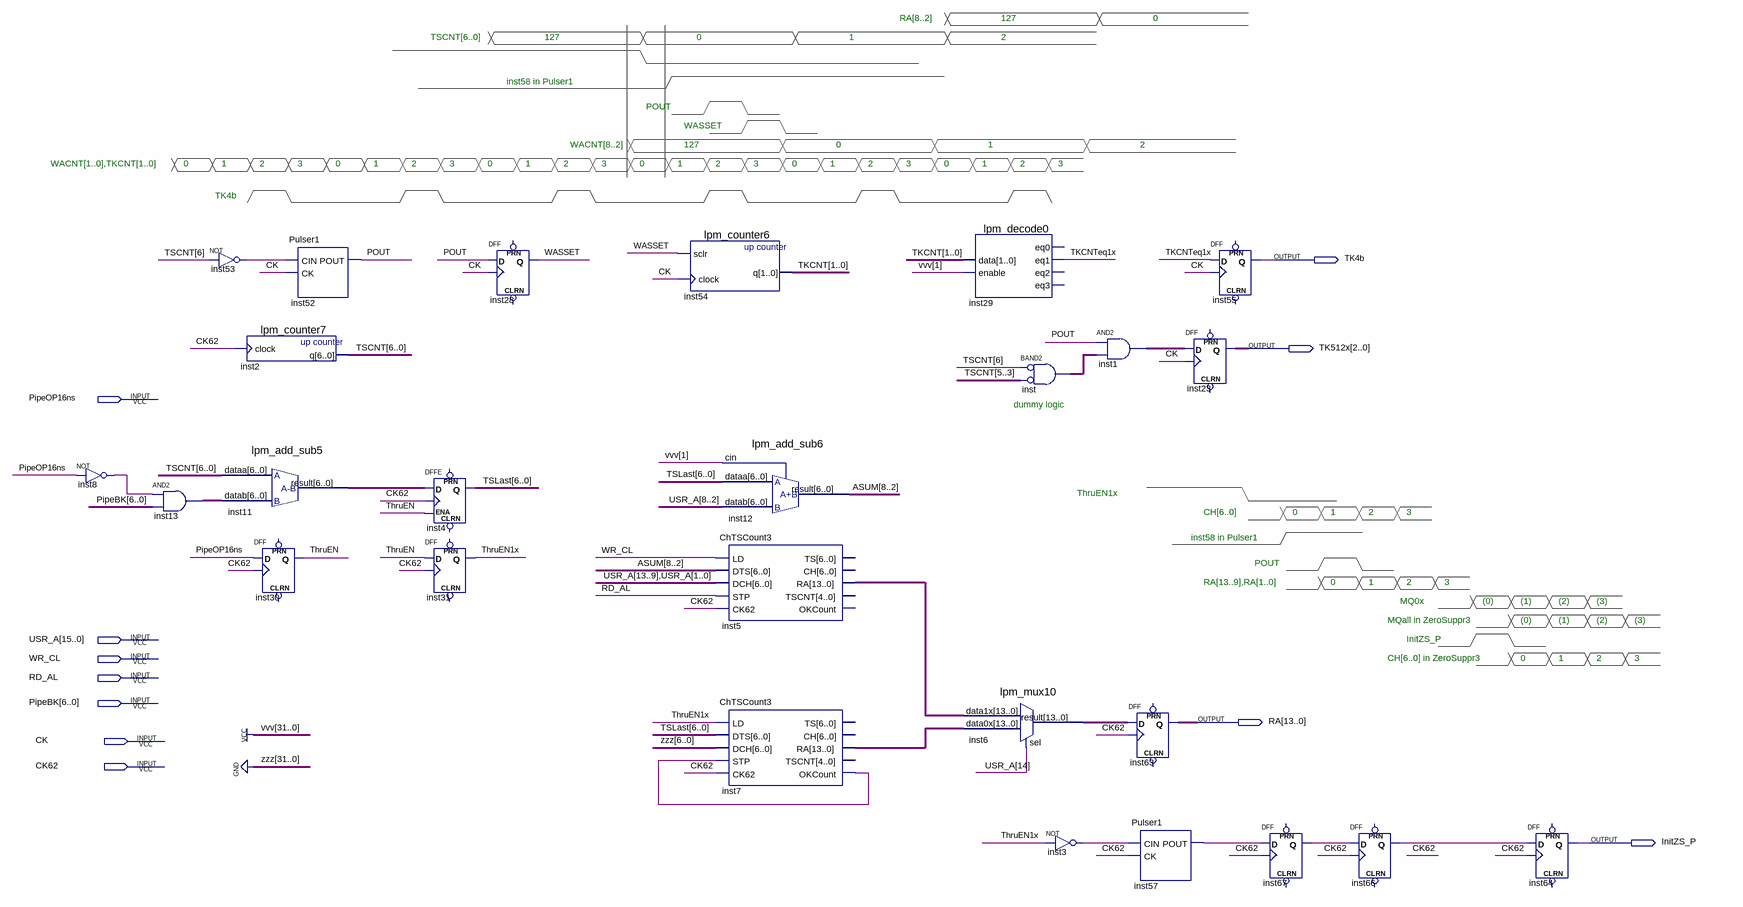
[diagram p0: schematic sheet]
// Quartus schematic PipeTime3.bdf as structural Verilog: 26 symbols, 11 pins
module PipeTime3 (
  input  PipeOP16ns,
  input  [15:0] USR_A,
  input  WR_CL,
  input  RD_AL,
  input  [6:0] PipeBK,
  input  CK,
  input  CK62,
  output TK4b,
  output [2:0] TK512x,
  output [13:0] RA,
  output InitZS_P
);

  wire inst3_out, inst7_okcount, inst8_out, inst53_out, inst57_pout, inst66_q, inst67_q, POUT, ThruEN,
       ThruEN1x, TKCNTeq1x, WASSET;
  wire [1:0] TKCNT;
  wire [2:0] inst1_out, inst_out;
  wire [6:0] inst11_result, inst13_out, TSCNT, TSLast;
  wire [8:2] ASUM;
  wire [13:0] inst5_ra, inst6_result, inst7_ra;

  not inst8 (inst8_out, PipeOP16ns);
  assign inst13_out = {7{inst8_out}} & PipeBK;  // AND2 inst13, 7 bits wide
  not inst53 (inst53_out, TSCNT[6]);
  lpm_counter7 inst2 (.clock(CK62), .q(TSCNT));
  lpm_add_sub5 inst11 (.dataa(TSCNT), .datab(inst13_out), .result(inst11_result));
  DFF inst30 (.CLK(CK62), .D(PipeOP16ns), .Q(ThruEN));  // open: CLRN, PRN
  Pulser1 inst52 (.CIN(inst53_out), .CK(CK), .POUT(POUT));
  DFFE inst4[6:0] (.D(inst11_result), .CLK(CK62), .ENA(ThruEN), .Q(TSLast));  // open: PRN, CLRN
  DFF inst31 (.CLK(CK62), .D(ThruEN), .Q(ThruEN1x));  // open: CLRN, PRN
  DFF inst28 (.CLK(CK), .D(POUT), .Q(WASSET));  // open: CLRN, PRN
  lpm_counter6 inst54 (.sclr(WASSET), .clock(CK), .q(TKCNT));
  lpm_add_sub6 inst12 (.dataa(TSLast), .datab(USR_A[8:2]), .cin(1'b1), .result(ASUM));
  ChTSCount3 inst5 (
    .LD(WR_CL), .DTS(ASUM), .DCH({USR_A[13:9], USR_A[1:0]}), .STP(RD_AL), .CK62(CK62), .RA(inst5_ra));  // open: TS, CH, TSCNT, OKCount
  ChTSCount3 inst7 (
    .LD(ThruEN1x), .DTS(TSLast), .DCH({7{1'b0}}), .STP(inst7_okcount), .CK62(CK62), .RA(inst7_ra),
    .OKCount(inst7_okcount));  // open: TS, CH, TSCNT
  lpm_decode0 inst29 (.data(TKCNT), .enable(1'b1), .eq1(TKCNTeq1x));  // open: eq0, eq2, eq3
  lpm_mux10 inst6 (.data1x(inst5_ra), .data0x(inst7_ra), .sel(USR_A[14]), .result(inst6_result));
  assign inst_out = ~{3{TSCNT[6]}} & ~TSCNT[5:3];  // BAND2 inst, 3 bits wide
  not inst3 (inst3_out, ThruEN1x);
  assign inst1_out = {3{POUT}} & inst_out;  // AND2 inst1, 3 bits wide
  DFF inst63[13:0] (.CLK(CK62), .D(inst6_result), .Q(RA));  // open: CLRN, PRN
  Pulser1 inst57 (.CIN(inst3_out), .CK(CK62), .POUT(inst57_pout));
  DFF inst55 (.CLK(CK), .D(TKCNTeq1x), .Q(TK4b));  // open: CLRN, PRN
  DFF inst23[2:0] (.CLK(CK), .D(inst1_out), .Q(TK512x));  // open: CLRN, PRN
  DFF inst67 (.CLK(CK62), .D(inst57_pout), .Q(inst67_q));  // open: CLRN, PRN
  DFF inst66 (.CLK(CK62), .D(inst67_q), .Q(inst66_q));  // open: CLRN, PRN
  DFF inst64 (.CLK(CK62), .D(inst66_q), .Q(InitZS_P));  // open: CLRN, PRN

  // Notes on the sheet:
  //   RA[8..2]
  //   127
  //   0
  //   TSCNT[6..0]
  //   127
  //   0
  //   1
  //   2
  //   inst58 in Pulser1
  //   POUT
  //   WASSET
  //   WACNT[8..2]
  //   127
  //   0
  //   1
  //   2
  //   WACNT[1..0],TKCNT[1..0]
  //   0
  //   1
  //   2
  //   3
  //   0
  //   1
  //   2
  //   3
  //   0
  //   1
  //   2
  //   3
  //   0
  //   1
  //   2
  //   3
  //   0
  //   1
  //   2
  //   3
  //   0
  //   1
  //   2
  //   3
  //   TK4b
  //   dummy logic
  //   ThruEN1x
  //   CH[6..0]
  //   0
  //   1
  //   2
  //   3
  //   inst58 in Pulser1
  //   POUT
  //   RA[13..9],RA[1..0]
  //   0
  //   1
  //   2
  //   3
  //   MQ0x
  //   (0)
  //   (1)
  //   (2)
  //   (3)
  //   MQall in ZeroSuppr3
  //   (0)
  //   (1)
  //   (2)
  //   (3)
  //   InitZS_P
  //   CH[6..0] in ZeroSuppr3
  //   0
  //   1
  //   2
  //   3
endmodule
